# EAGLE design KLineAdapter (EAGLE 6.1)
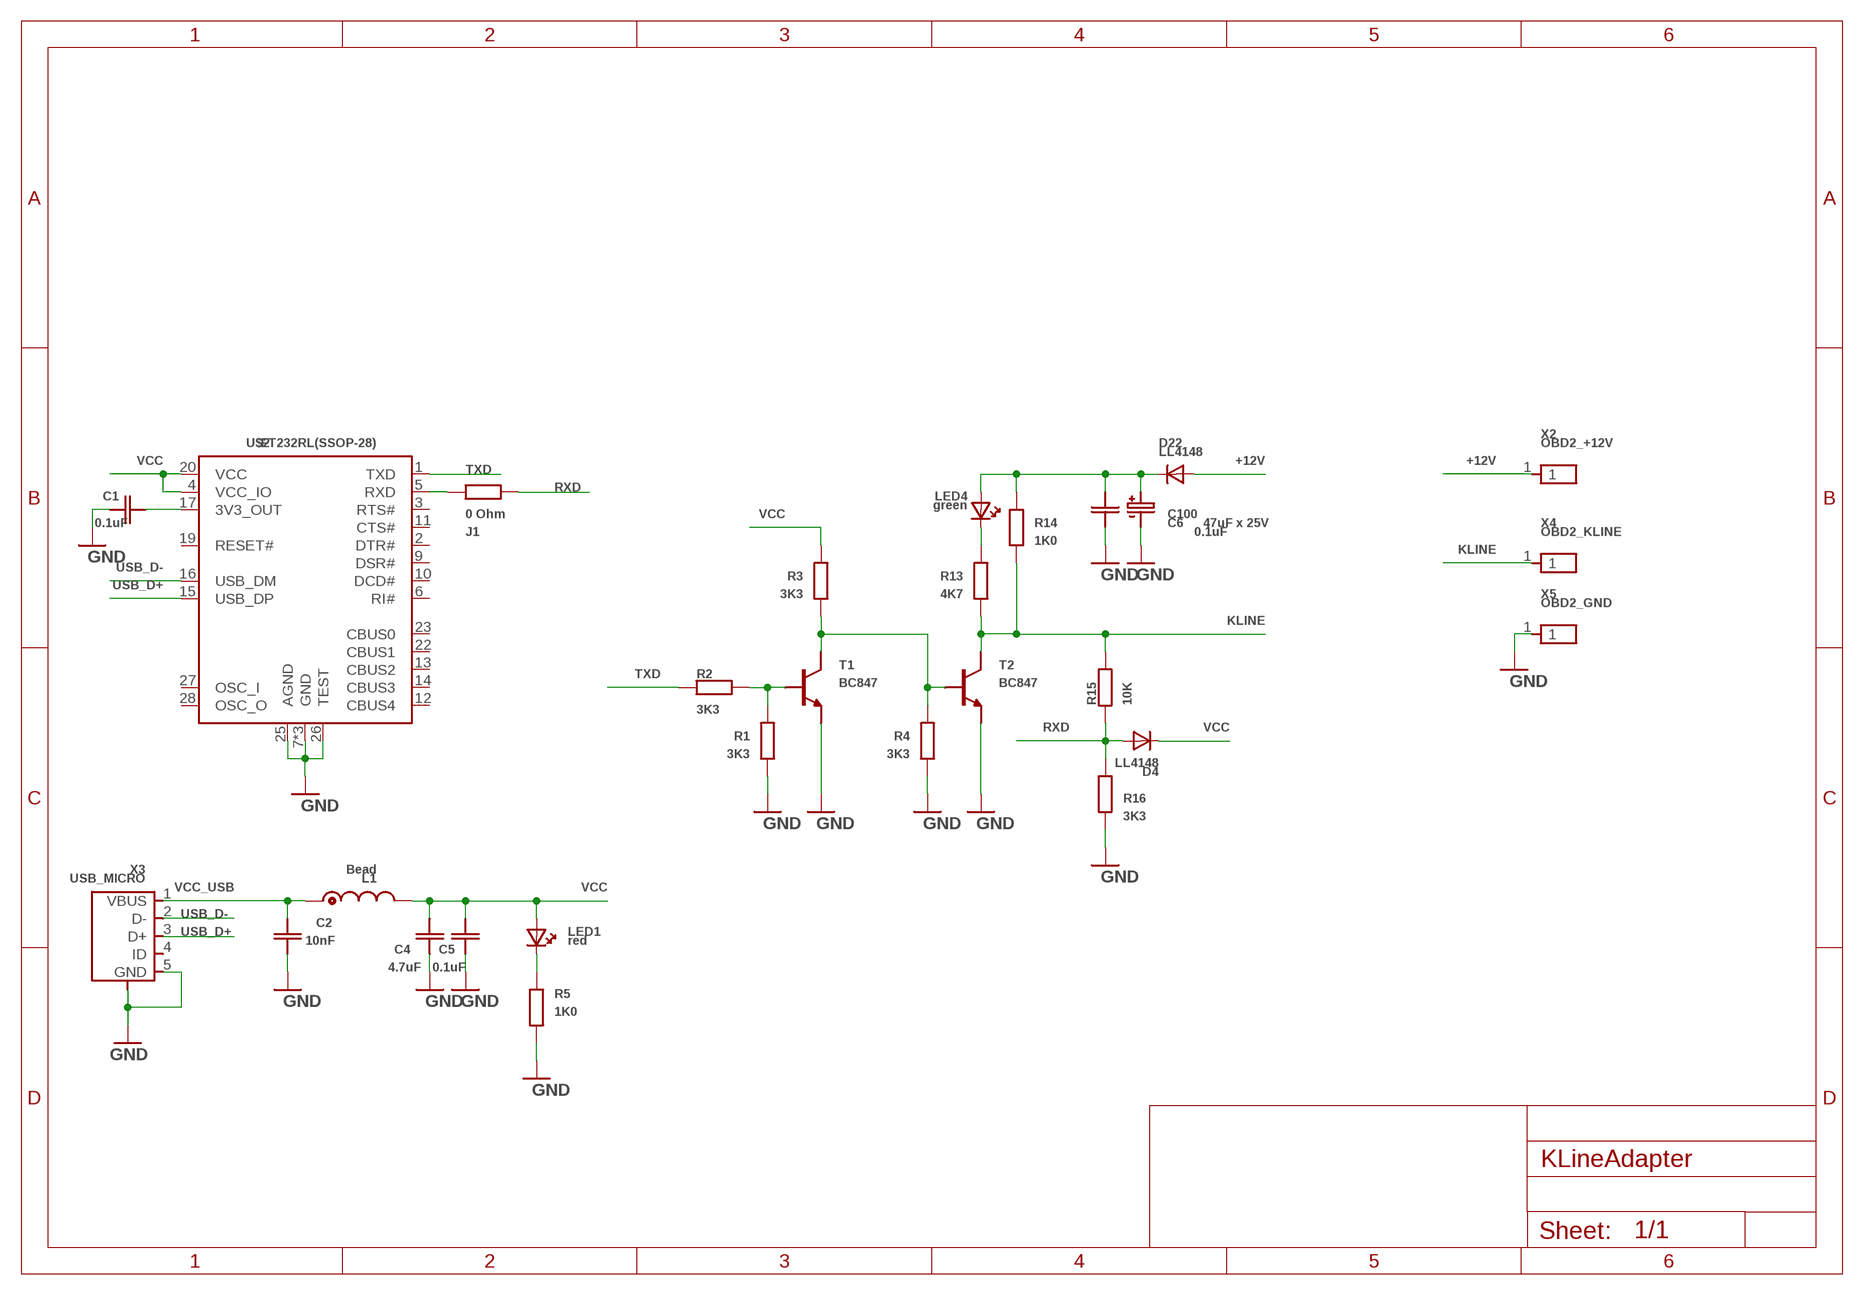
[diagram p0: schematic, sheet 1]

## Parts
C1  0.1uF  CSMD_0805  [RSMD_0805]
C2  10nF  CSMD_0805  [RSMD_0805]
C4  4.7uF  CSMD_1206  [RSMD_1206]
C5  0.1uF  CSMD_0805  [RSMD_0805]
C6  0.1uF  CSMD_0805  [RSMD_0805]
C100  47uF x 25V  CE5.2MM  [CE_5.2MM]
D4  LL4148  LL4147SOD-80  [SOD-80]
D22  LL4148  LL4147SOD-80  [SOD-80]
J1  0 Ohm  RSMD_0805  [RSMD_0805]
L1  Bead  L  [RSMD_1206]
LED1  red  LED3MM(SMD0805)  [LED_0805]
LED4  green  LED3MM(SMD0805)  [LED_0805]
R1  3K3  RSMD_0805  [RSMD_0805]
R2  3K3  RSMD_0805  [RSMD_0805]
R3  3K3  RSMD_0805  [RSMD_0805]
R4  3K3  RSMD_0805  [RSMD_0805]
R5  1K0  RSMD_0805  [RSMD_0805]
R13  4K7  RSMD_0805  [RSMD_0805]
R14  1K0  RSMD_0805  [RSMD_0805]
R15  10K  RSMD_0805  [RSMD_0805]
R16  3K3  RSMD_0805  [RSMD_0805]
T1  BC847  BC847SOT23_SMALL_PADS  [SOT23_SMALL_PADS]
T2  BC847  BC847SOT23_SMALL_PADS  [SOT23_SMALL_PADS]
U$2  FT232RL(SSOP-28)  [SSOP-28]
X2  OBD2_+12V  PIN1X13.5MM_PWR  [PIN1X1_3.5MM_PWR]
X3  USB_MICRO  USB_MICROMICRO  [USB_MICRO_TYPE_B]
X4  OBD2_KLINE  PIN1X13.5MM_PWR  [PIN1X1_3.5MM_PWR]
X5  OBD2_GND  PIN1X13.5MM_PWR  [PIN1X1_3.5MM_PWR]

## Nets
+12V: D22.ANODE X2.1
GND: C1.PAD_0(PIN0) C2.PAD_0(PIN0) C4.PAD_0(PIN0) C5.PAD_0(PIN0) C6.PAD_0(PIN0) C100.MINUS R1.PAD_1(PIN1) R4.PAD_1(PIN1) R5.PAD_0(PIN0) R16.PAD_0(PIN0) T1.2(E) T2.2(E) U$2.7(GND) U$2.18(GND) U$2.21(GND) U$2.25(AGND) U$2.26(TEST) X3.5(GND) X3.PACKAGE1(PACKAGE) X3.PACKAGE2(PACKAGE) X3.PACKAGE3(PACKAGE) X3.PACKAGE4(PACKAGE) X3.PACKAGE5(PACKAGE) X5.1
KLINE: R13.PAD_0(PIN0) R14.PAD_0(PIN0) R15.PAD_1(PIN1) T2.3(C) X4.1
N$1: C1.PAD_1(PIN1) U$2.17(3V3_OUT)
N$2: J1.PAD_0(PIN0) U$2.5(RXD)
N$3: R1.PAD_0(PIN0) R2.PAD_1(PIN1) T1.1(B)
N$4: R3.PAD_0(PIN0) R4.PAD_0(PIN0) T1.3(C) T2.1(B)
N$5: C6.PAD_1(PIN1) C100.PLUS D22.CATHODE LED4.ANODE R14.PAD_1(PIN1)
N$6: LED1.CATHODE R5.PAD_1(PIN1)
N$9: LED4.CATHODE R13.PAD_1(PIN1)
RXD: D4.ANODE J1.PAD_1(PIN1) R15.PAD_0(PIN0) R16.PAD_1(PIN1)
TXD: R2.PAD_0(PIN0) U$2.1(TXD)
USB_D+: U$2.15(USB_DP) X3.3(D+)
USB_D-: U$2.16(USB_DM) X3.2(D-)
VCC: C4.PAD_1(PIN1) C5.PAD_1(PIN1) D4.CATHODE L1.PAD_0(END) LED1.ANODE R3.PAD_1(PIN1) U$2.4(VCC_IO) U$2.20(VCC)
VCC_USB: C2.PAD_1(PIN1) L1.PAD_1(START) X3.1(VBUS)
Unconnected: U$2.2(DTR#) U$2.3(RTS#) U$2.6(RI#) U$2.9(DSR#) U$2.10(DCD#) U$2.11(CTS#) U$2.12(CBUS4) U$2.13(CBUS2) U$2.14(CBUS3) U$2.19(RESET#) U$2.22(CBUS1) U$2.23(CBUS0) U$2.27(OSC_I) U$2.28(OSC_O) X3.4(ID)

## Library data of the parts
C1 C2 C4-C6 = __MyCommonLib1:C
C100 = __MyCommonLib1:CE
D4 D22 = __MyCommonLib1:LL4147
J1 R1-R5 R13-R16 = __MyCommonLib1:R
L1 = __MyCommonLib1:L
LED1 LED4 = __MyCommonLib1:LED3MM
T1 T2 = __MyCommonLib1:BC847
U$2 = __MyCommonLib1:FT232RL
X2 X4 X5 = __MyCommonLib1:PIN1X1
X3 = __MyCommonLib1:USB_MICRO

## Board
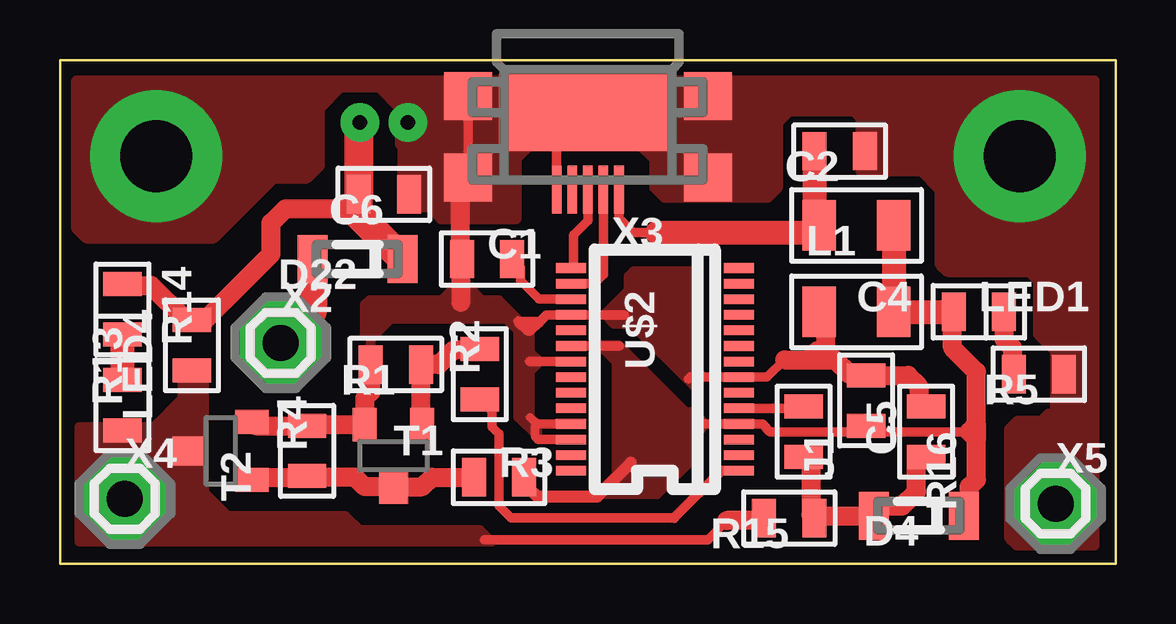
[diagram p1: board, top side]
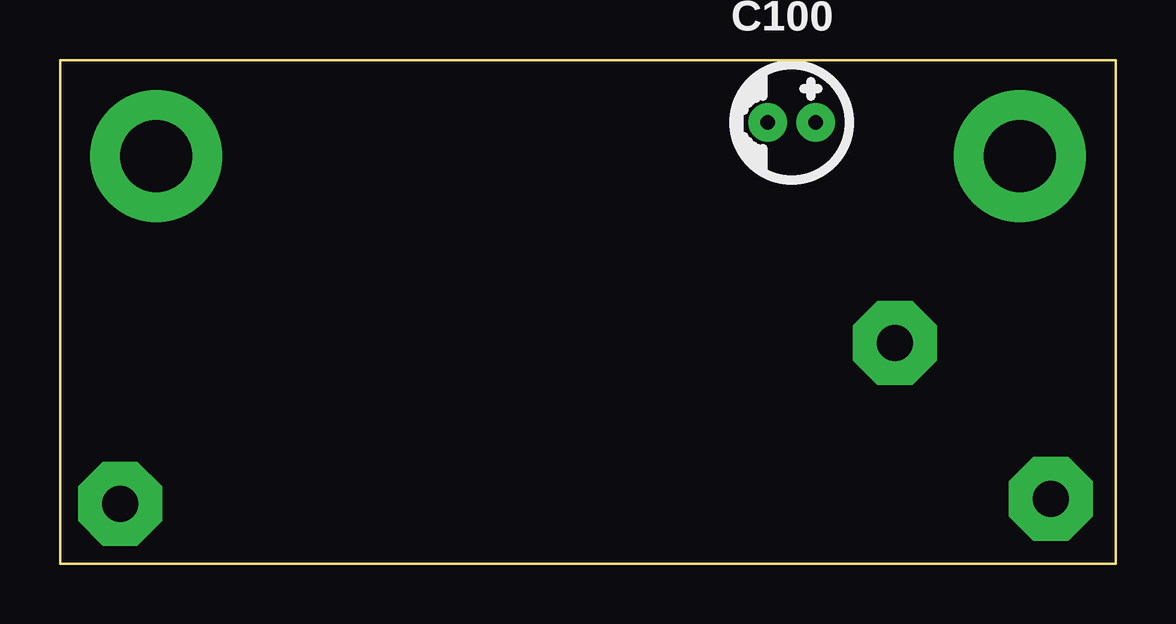
[diagram p2: board, bottom side, seen from below]

Size 44 x 21 mm. Coordinates in mm from the lower left corner, seen from the top.
Outline: 0,0 0,21 44,21 44,0 0,0
Copper layers (1*16): Top 0.035mm / dielectric 1.5mm / Bottom 0.035mm
Design rules: minimum track width 0.35mm, minimum drill 0.6mm, track to track 0.25mm, track to pad 0.25mm, pad to pad 0.25mm, via to via 0.25mm, smd to smd 0mil, copper to edge 0.2mm, drill to drill 8mil, minimum pad ring 10mil, minimum via ring 8mil, stop-mask expansion 4mil, vias tented up to drill 0mil, thermal gap 10mil

### Footprints (pad centres in the part's own frame; a part is rotated, then mirrored left to right if it is on the bottom)
RSMD_0805 = smd 1 x 1.6: PAD_0 -1.05,0; PAD_1 1.05,0
RSMD_1206 = smd 1.4 x 2.1: PAD_0 -1.55,0; PAD_1 1.55,0
CE_5.2MM = drill 0.6 pad 1.6: MINUS -1,0; PLUS 1,0
SOD-80 = smd 1.25 x 2: ANODE 1.875,0; CATHODE -1.875,0
LED_0805 = smd 1 x 1.6: ANODE -1.05,0; CATHODE 1.05,0
SOT23_SMALL_PADS = smd 1 x 1.4: 1 1.2,1.3; 2 -1.2,1.3 | smd 1.2 x 1.4: 3 0,-1.3
SSOP-28 = smd 0.4 x 1.25: 1 -4.225,-3.5; 2 -3.575,-3.5; 3 -2.925,-3.5; 4 -2.275,-3.5; 5 -1.625,-3.5; 6 -0.975,-3.5; 7 -0.325,-3.5; 8 0.325,-3.5; 9 0.975,-3.5; 10 1.625,-3.5; 11 2.275,-3.5; 12 2.925,-3.5; 13 3.575,-3.5; 14 4.225,-3.5; 15 4.225,3.5; 16 3.575,3.5; 17 2.925,3.5; 18 2.275,3.5; 19 1.625,3.5; 20 0.975,3.5; 21 0.325,3.5; 22 -0.325,3.5; 23 -0.975,3.5; 24 -1.625,3.5; 25 -2.275,3.5; 26 -2.925,3.5; 27 -3.575,3.5; 28 -4.225,3.5
PIN1X1_3.5MM_PWR = drill 1.5 pad 3.5 octagon: 1 0,0
USB_MICRO_TYPE_B = smd 0.4 x 2: 1 -1.3,5.2; 2 -0.65,5.2; 3 0,5.2; 4 0.65,5.2; 5 1.3,5.2 | smd 7.4 x 3.2: PACKAGE1 0,2 | smd 2 x 2: PACKAGE2 -5,4.7; PACKAGE3 -5,1.3; PACKAGE4 5,1.3; PACKAGE5 5,4.7

### Placement (x,y rotation side)
C1  17.8,12.7 0 top
C2  32.5,17.2 180 top
C4  33.2,10.5 0 top
C5  33.6,6.8 270 top
C6  13.5,15.4 180 top
C100  13.5,18.4 0 bottom
D4  35.8,2 180 top
D22  12.4,12.7 180 top
J1  31,5.5 270 top
L1  33.2,14.1 180 top
LED1  38.3,10.5 0 top
LED4  2.6,10.6 270 top
R1  14,8.3 180 top
R2  17.5,7.9 90 top
R3  18.3,3.6 0 top
R4  10.3,4.7 90 top
R5  40.8,7.9 180 top
R13  2.6,6.6 90 top
R14  5.5,9.1 90 top
R15  30.4,1.9 180 top
R16  36.1,5.5 270 top
T1  13.9,4.5 0 top
T2  6.7,4.7 270 top
U$2  24.8,8.1 90 top
X2  9.2,9.2 0 top
X3  22,20.8 180 top
X4  2.7,2.7 0 top
X5  41.5,2.5 0 top

### Tracks (layer width: path | path; a pad name or v marks a point on that pad's centre or on a via)
+12V
  Top 1.2: D22.ANODE 10.53,10.53 X2.1
GND  (via drill 3 pad 5.5)
  Top 0.35: 19.6,6.1 19.88,5.83 19.8,5.75 19.8,5.3 19.93,5.17
  Top 0.4: X3.5 20.7,18 | 23.52,10.38 U$2.18 20.27,10.38 19.8,9.9 | 26.2,7.7 26.27,7.78 U$2.7 29.48,7.78 30.2,8.5 | X3.PACKAGE5 X3.PACKAGE4 | U$2.25 19.88,5.83 | U$2.26 19.93,5.17 | U$2.21 19.57,8.43
  Top 0.42: 20,10.1 19.8,9.9 19.6,9.7 19.5,9.7 19.1,10.1 20,10.1
  Top 0.8: T2.2 8.15,5.75 R4.PAD_1 10.35,5.8 T1.2 12.7,6.9 12.95,7.15 R1.PAD_1 | R16.PAD_0 36.1,6.6 35.8,6.9 35.8,7.4 35.35,7.85 C5.PAD_0 33.55,7.9 32.9,7.9 32.3,8.5 | 32.3,8.5 31.9,8.9 | C4.PAD_0 31.9,10.25 31.9,8.9 | 30.2,8.5 31.2,8.5 | 31.2,8.5 31.6,8.9 31.9,8.9 | 31.2,8.5 32.3,8.5 | 16.7,10.9 16.7,12.65 C1.PAD_0 16.7,12.75 16.7,15.2
  other vias: 4,17 40,17
  pour Top (no thermals): 39.9,0.8 43.1,0.8 43.1,20.1 0.7,20.1 0.7,14 1.1,13.6 6.4,13.6 8.9,16.1 10.3,16.1 10.8,16.6 10.8,19 11.7,19.9 13.3,19.9 14.2,19 14.2,17.5 14.3,17.4 14.3,14.9 15.4,14.9 15.9,14.4 19,14.4 19,16.9 19.6,17.5 24.2,17.5 24.8,16.9 24.8,15.7 25.2,15.3 29.5,15.3 29.9,15.7 29.9,18.4 30.4,18.9 33.1,18.9 33.4,18.6 33.4,16.4 35.9,16.4 36.7,15.6 36.7,12.5 37,12.2 40.4,12.2 40.8,11.8 40.8,9.6 41.5,8.9 41.5,6.2 41.2,6.2 40.9,5.9 39.9,5.9 39.6,5.6 39.6,1.1
  pour Top: 19.9,5.8 19.9,5.3 19.1,6.1 19.1,9.7 18.6,10.2 13.8,10.2 13.2,9.6 13.2,8.1 12.7,8.1 12.7,10.8 12.9,11 15.9,11 16.5,11.6 16.5,13.2 17,13.2 17,11.6 17.6,11 18.3,11 19.6,9.7 19.6,8.8 20,8.4 19.6,8 19.6,6.1
  pour Top: 22.7,10.4 23.7,11.4 23.7,12 23.9,12.2 26.3,12.2 26.4,12.1 26.4,9.2 26.4,8.2 26.8,7.8 26.4,7.4 23.8,10 23.2,10 23.1,10
KLINE
  Top 0.4: 17.7,1 27,1 27.8,1.8
  Top 0.8: R15.PAD_1 29.25,1.8 27.8,1.8
  pour Top (no thermals): 0.8,5.7 3.9,5.7 5.1,6.9 5.1,8.2 6,8.2 6,3 7,2 11.9,2 12.5,1.4 17.5,1.4 18,0.9 0.8,0.9
N$1
  Top 0.4: U$2.17 19.98,11.03 19.2,11.8 19.2,12.35 C1.PAD_1
N$2
  Top 0.4: U$2.5 30.93,6.47 J1.PAD_0
N$3
  Top 0.8: T1.1 15.05,5.85 R1.PAD_0 15.8,8.3 16.4,8.9 17.45,8.9 R2.PAD_1
N$4
  Top 0.8: T2.1 8.1,3.6 10.3,3.6 R4.PAD_0 10.35,3.6 12.3,3.6 12.7,3.2 T1.3 15.1,3.2 15.5,3.6 R3.PAD_0
N$5
  Top 0.8: 12.45,14.8 9.4,14.8 8.8,14.2 8.8,12.9 6.05,10.15 R14.PAD_1 5.25,10.15 3.8,11.6 2.65,11.6 LED4.ANODE
  Top 1.2: D22.CATHODE 12.45,14.53 12.45,14.8 C6.PAD_1 12.45,18.35 C100.PLUS
N$6
  Top 0.8: LED1.CATHODE 39.35,9.35 39.7,9 39.7,7.95 R5.PAD_1
N$9
  Top 1: LED4.CATHODE R13.PAD_1
RXD
  Top 0.8: J1.PAD_1 31.3,4.15 31.3,2.05 R15.PAD_0 31.55,2 D4.ANODE 34.33,2.4 35.1,2.4 35.7,3 35.7,4.05 R16.PAD_1
TXD
  Top 0.4: 25.6,1.9 18.8,1.9 18.3,2.4 18.3,5.4 18,5.7 18,6.35 R2.PAD_0 | U$2.1 27.57,3.88
  Top 0.42: 27.57,3.88 25.6,1.9
USB_D+
  Top 0.4: X3.3 22,14.3 21.4,13.7 21.4,12.43 U$2.15
USB_D-
  Top 0.4: X3.2 22.65,12.05 22.27,11.68 U$2.16
VCC
  Top 0.4: U$2.20 23.32,9.07 | 26.62,5.83 U$2.4 29.27,5.83 29.6,5.5 33.35,5.5 C5.PAD_1 33.85,5.5 37.9,5.5
  Top 0.5: R3.PAD_1 19.6,3.35 19.6,3.1 19.9,2.8 22.4,2.8 23.8,4.2
  Top 0.8: D4.CATHODE 37.9,2.23 37.9,3.2 38.2,3.5 38.2,5.2 | 38.2,5.2 37.9,5.5 38.2,5.8 | 38.2,5.8 38.2,8 37.2,9 37.2,10.45 LED1.ANODE | 38.2,5.8 38.2,5.2
  Top 1: L1.PAD_0 C4.PAD_1 LED1.ANODE
  pour Top: 22.5,9.1 23.2,8.4 23.2,3.7 22.4,2.9 24.9,2.9 26.5,4.5 26.5,5.4 26.9,5.8 26.4,6.3 26.1,6.3 23.3,9.1
VCC_USB
  Top 0.4: X3.1 23.3,14.4 23.9,13.8 24.9,13.8
  Top 1: 24.9,13.8 31.6,13.8 31.6,14.05 L1.PAD_1 31.45,14.1 C2.PAD_1